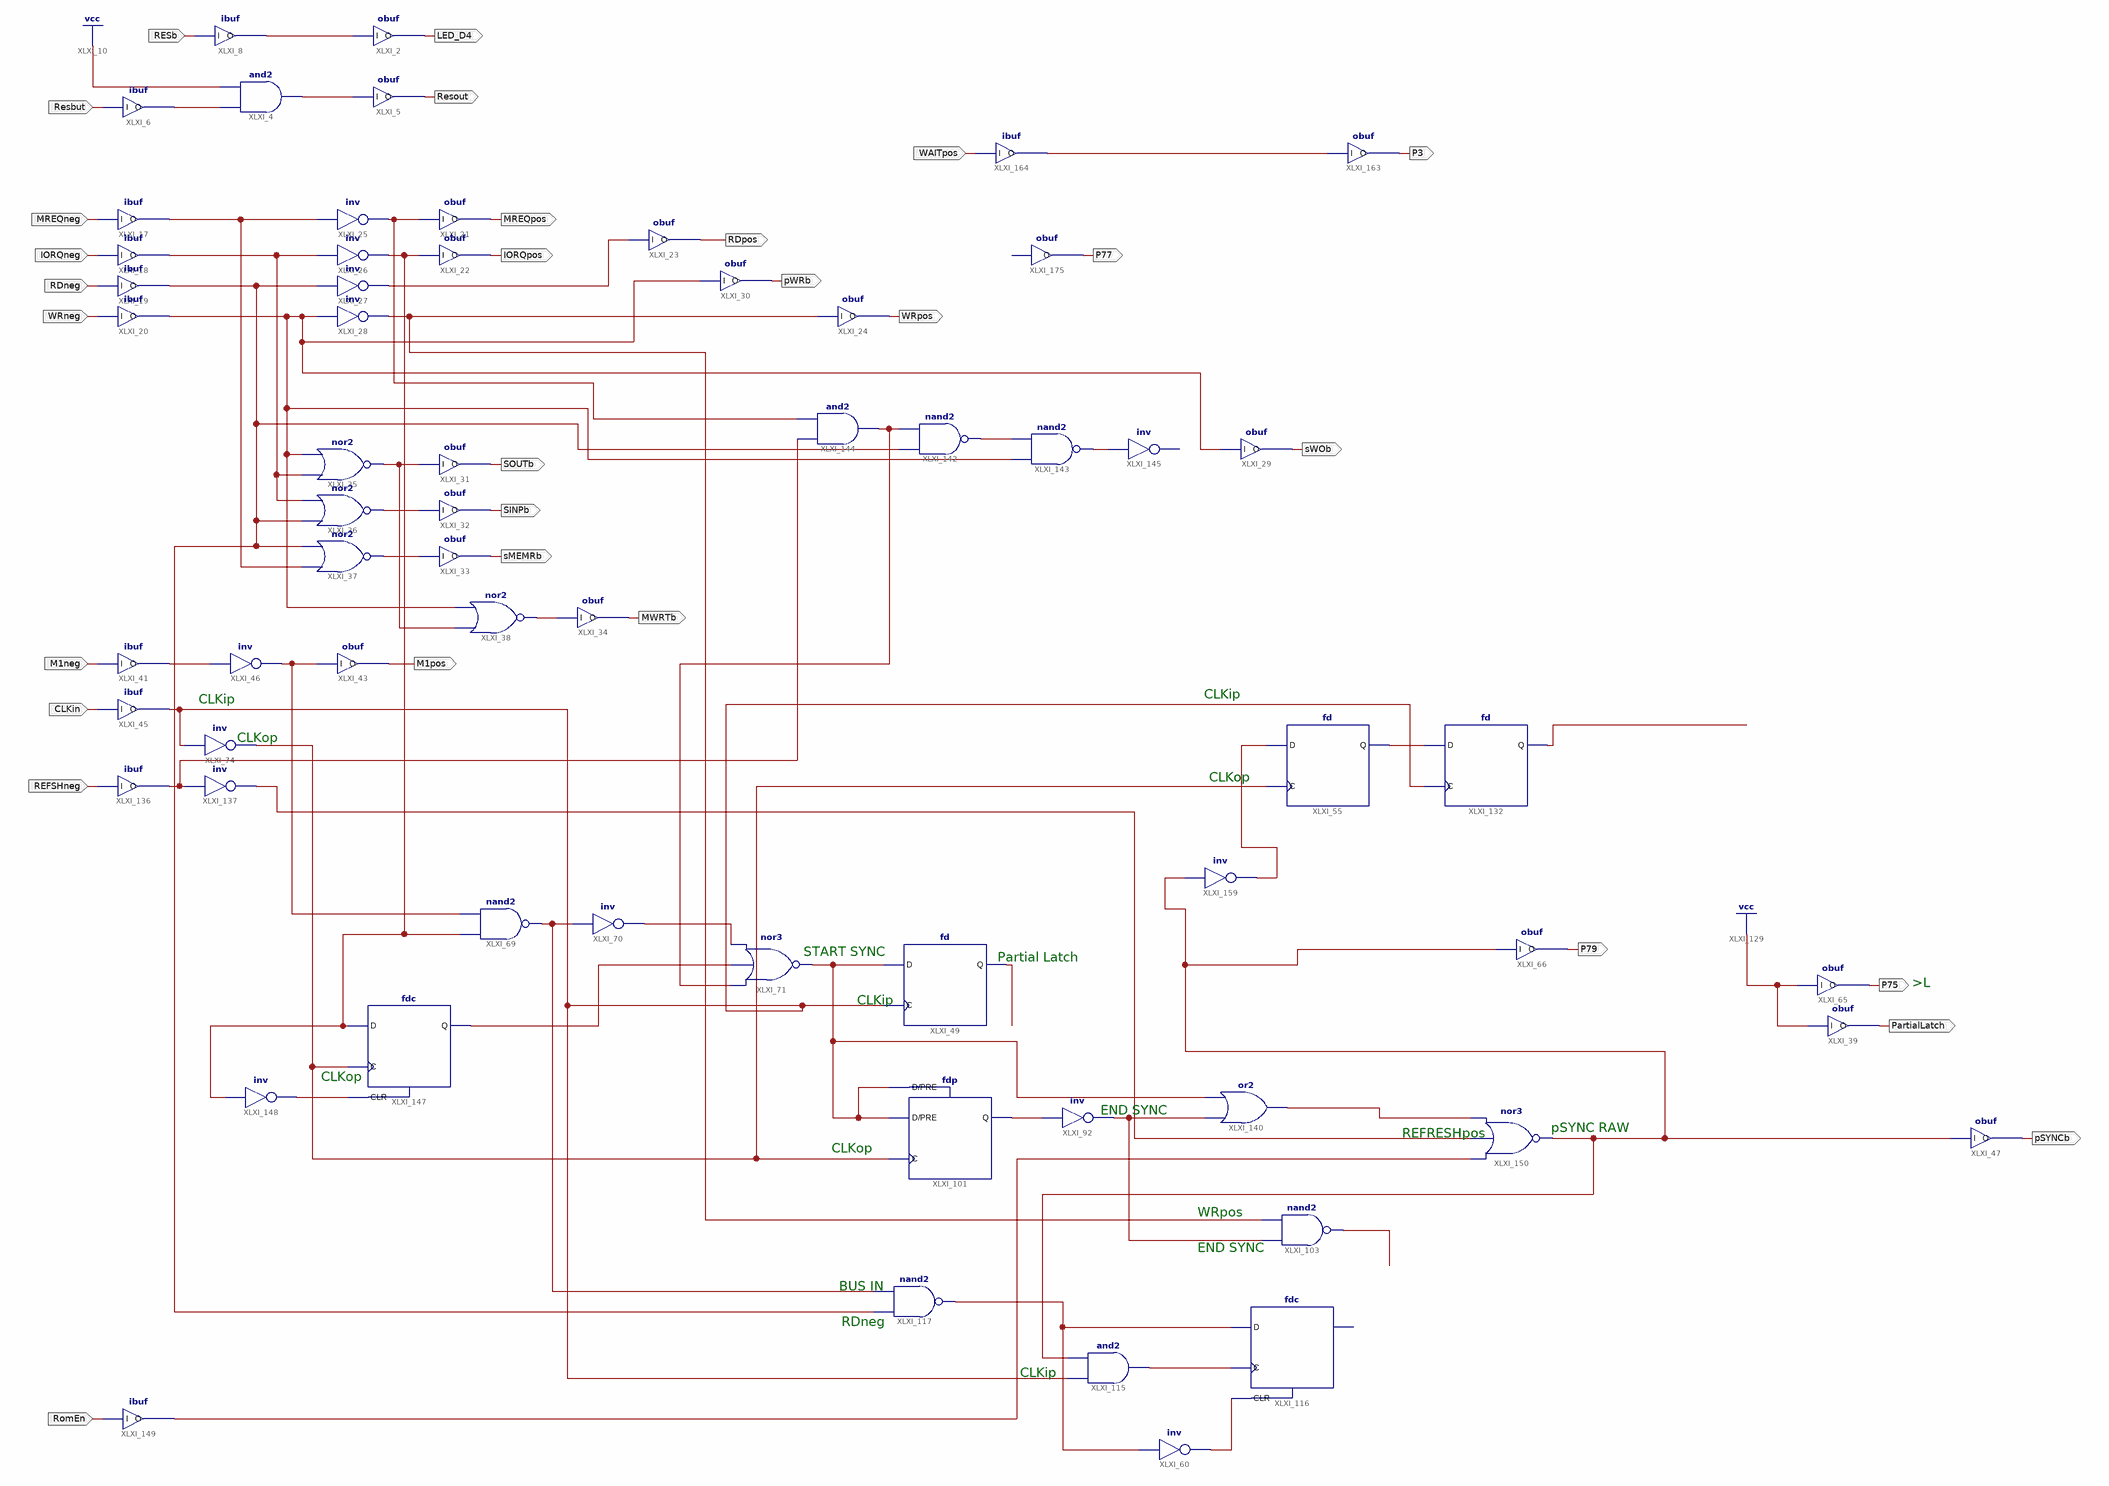
[diagram p0: schematic sheet 1]
// Xilinx ISE schematic IC1v2_3.sch (xc9500) as structural Verilog: 64 symbols, 30 ports
module IC1v2_3 (
  input  Resbut,
  input  RESb,
  input  MREQneg,
  input  IORQneg,
  input  RDneg,
  input  WRneg,
  input  M1neg,
  input  CLKin,
  input  REFSHneg,
  input  RomEn,
  input  WAITpos,
  output Resout,
  output LED_D4,
  output MREQpos,
  output IORQpos,
  output SOUTb,
  output SINPb,
  output sMEMRb,
  output MWRTb,
  output M1pos,
  output sWOb,
  output P79,
  output pSYNCb,
  output P75,
  output PartialLatch,
  output P3,
  output P77,
  output pWRb,
  output WRpos,
  output RDpos
);

  wire XLXN_6, XLXN_10, XLXN_13, XLXN_40, XLXN_44, XLXN_45, XLXN_48, XLXN_54, XLXN_56, XLXN_58, XLXN_64,
       XLXN_67, XLXN_75, XLXN_129, XLXN_131, XLXN_133, XLXN_134, XLXN_157, XLXN_164, XLXN_169, XLXN_182,
       XLXN_183, XLXN_184, XLXN_185, XLXN_190, XLXN_222, XLXN_226, XLXN_230, XLXN_232, XLXN_233, XLXN_234,
       XLXN_239, XLXN_240, XLXN_242, XLXN_253, XLXN_269, XLXN_270, XLXN_271, XLXN_273, XLXN_283, XLXN_294,
       XLXN_295, XLXN_296;

  and XLXI_4 (XLXN_13, XLXN_6, 1'b1);
  obuf XLXI_5 (.I(XLXN_13), .O(Resout));
  ibuf XLXI_6 (.I(Resbut), .O(XLXN_6));
  obuf XLXI_2 (.I(XLXN_10), .O(LED_D4));
  ibuf XLXI_8 (.I(RESb), .O(XLXN_10));
  ibuf XLXI_17 (.I(MREQneg), .O(XLXN_58));
  ibuf XLXI_18 (.I(IORQneg), .O(XLXN_54));
  ibuf XLXI_19 (.I(RDneg), .O(XLXN_56));
  ibuf XLXI_20 (.I(WRneg), .O(XLXN_40));
  obuf XLXI_21 (.I(XLXN_75), .O(MREQpos));
  obuf XLXI_22 (.I(XLXN_240), .O(IORQpos));
  not XLXI_25 (XLXN_75, XLXN_58);
  not XLXI_26 (XLXN_240, XLXN_54);
  not XLXI_27 (XLXN_294, XLXN_56);
  not XLXI_28 (XLXN_295, XLXN_40);
  obuf XLXI_31 (.I(XLXN_48), .O(SOUTb));
  obuf XLXI_32 (.I(XLXN_190), .O(SINPb));
  obuf XLXI_33 (.I(XLXN_45), .O(sMEMRb));
  obuf XLXI_34 (.I(XLXN_44), .O(MWRTb));
  nor XLXI_35 (XLXN_48, XLXN_54, XLXN_40);
  nor XLXI_36 (XLXN_190, XLXN_56, XLXN_54);
  nor XLXI_37 (XLXN_45, XLXN_58, XLXN_56);
  nor XLXI_38 (XLXN_44, XLXN_48, XLXN_40);
  ibuf XLXI_41 (.I(M1neg), .O(XLXN_64));
  obuf XLXI_43 (.I(XLXN_67), .O(M1pos));
  ibuf XLXI_45 (.I(CLKin), .O(XLXN_133));
  not XLXI_46 (XLXN_67, XLXN_64);
  fd XLXI_49 (.C(XLXN_133), .D(XLXN_164), .Q(XLXN_296));
  nand XLXI_69 (XLXN_185, XLXN_240, XLXN_67);
  not XLXI_70 (XLXN_129, XLXN_185);
  nor XLXI_71 (XLXN_164, XLXN_253, XLXN_134, XLXN_129);
  not XLXI_74 (XLXN_131, XLXN_133);
  not XLXI_92 (XLXN_169, XLXN_157);
  fdp XLXI_101 (.C(XLXN_131), .D(XLXN_164), .PRE(XLXN_164), .Q(XLXN_157));
  nand XLXI_103 (XLXN_283, XLXN_169, XLXN_295);
  fd XLXI_55 (.C(XLXN_131), .D(XLXN_271), .Q(XLXN_232));
  not XLXI_60 (XLXN_184, XLXN_182);
  and XLXI_115 (XLXN_183, XLXN_133, XLXN_270);
  fdc XLXI_116 (.C(XLXN_183), .CLR(XLXN_184), .D(XLXN_182));  // open: Q
  nand XLXI_117 (XLXN_182, XLXN_56, XLXN_185);
  fd XLXI_132 (.C(XLXN_133), .D(XLXN_232), .Q(XLXN_222));
  ibuf XLXI_136 (.I(REFSHneg), .O(XLXN_226));
  not XLXI_137 (XLXN_230, XLXN_226);
  or XLXI_140 (XLXN_269, XLXN_169, XLXN_164);
  nand XLXI_142 (XLXN_234, XLXN_56, XLXN_253);
  nand XLXI_143 (XLXN_233, XLXN_40, XLXN_234);
  and XLXI_144 (XLXN_253, XLXN_226, XLXN_75);
  // inv XLXI_145 has open pins: I=XLXN_233, O=open
  obuf XLXI_29 (.I(XLXN_40), .O(sWOb));
  fdc XLXI_147 (.C(XLXN_131), .CLR(XLXN_239), .D(XLXN_240), .Q(XLXN_134));
  not XLXI_148 (XLXN_239, XLXN_240);
  ibuf XLXI_149 (.I(RomEn), .O(XLXN_242));
  nor XLXI_150 (XLXN_270, XLXN_242, XLXN_230, XLXN_269);
  obuf XLXI_66 (.I(XLXN_270), .O(P79));
  obuf XLXI_47 (.I(XLXN_270), .O(pSYNCb));
  obuf XLXI_65 (.I(1'b1), .O(P75));
  obuf XLXI_39 (.I(1'b1), .O(PartialLatch));
  not XLXI_159 (XLXN_271, XLXN_270);
  ibuf XLXI_164 (.I(WAITpos), .O(XLXN_273));
  obuf XLXI_163 (.I(XLXN_273), .O(P3));
  obuf XLXI_175 (.O(P77));  // open: I
  obuf XLXI_30 (.I(XLXN_40), .O(pWRb));
  obuf XLXI_24 (.I(XLXN_295), .O(WRpos));
  obuf XLXI_23 (.I(XLXN_294), .O(RDpos));

  // Notes on the sheet:
  //   CLKip
  //   CLKip
  //   CLKop
  //   CLKop
  //   START SYNC
  //   Partial Latch
  //   >L
  //   CLKip
  //   CLKop
  //   END SYNC
  //   pSYNC RAW
  //   REFRESHpos
  //   CLKop
  //   WRpos
  //   END SYNC
  //   BUS IN
  //   RDneg
  //   CLKip
endmodule
